# EAGLE schematic ESP32 (EAGLE 9.6.2)
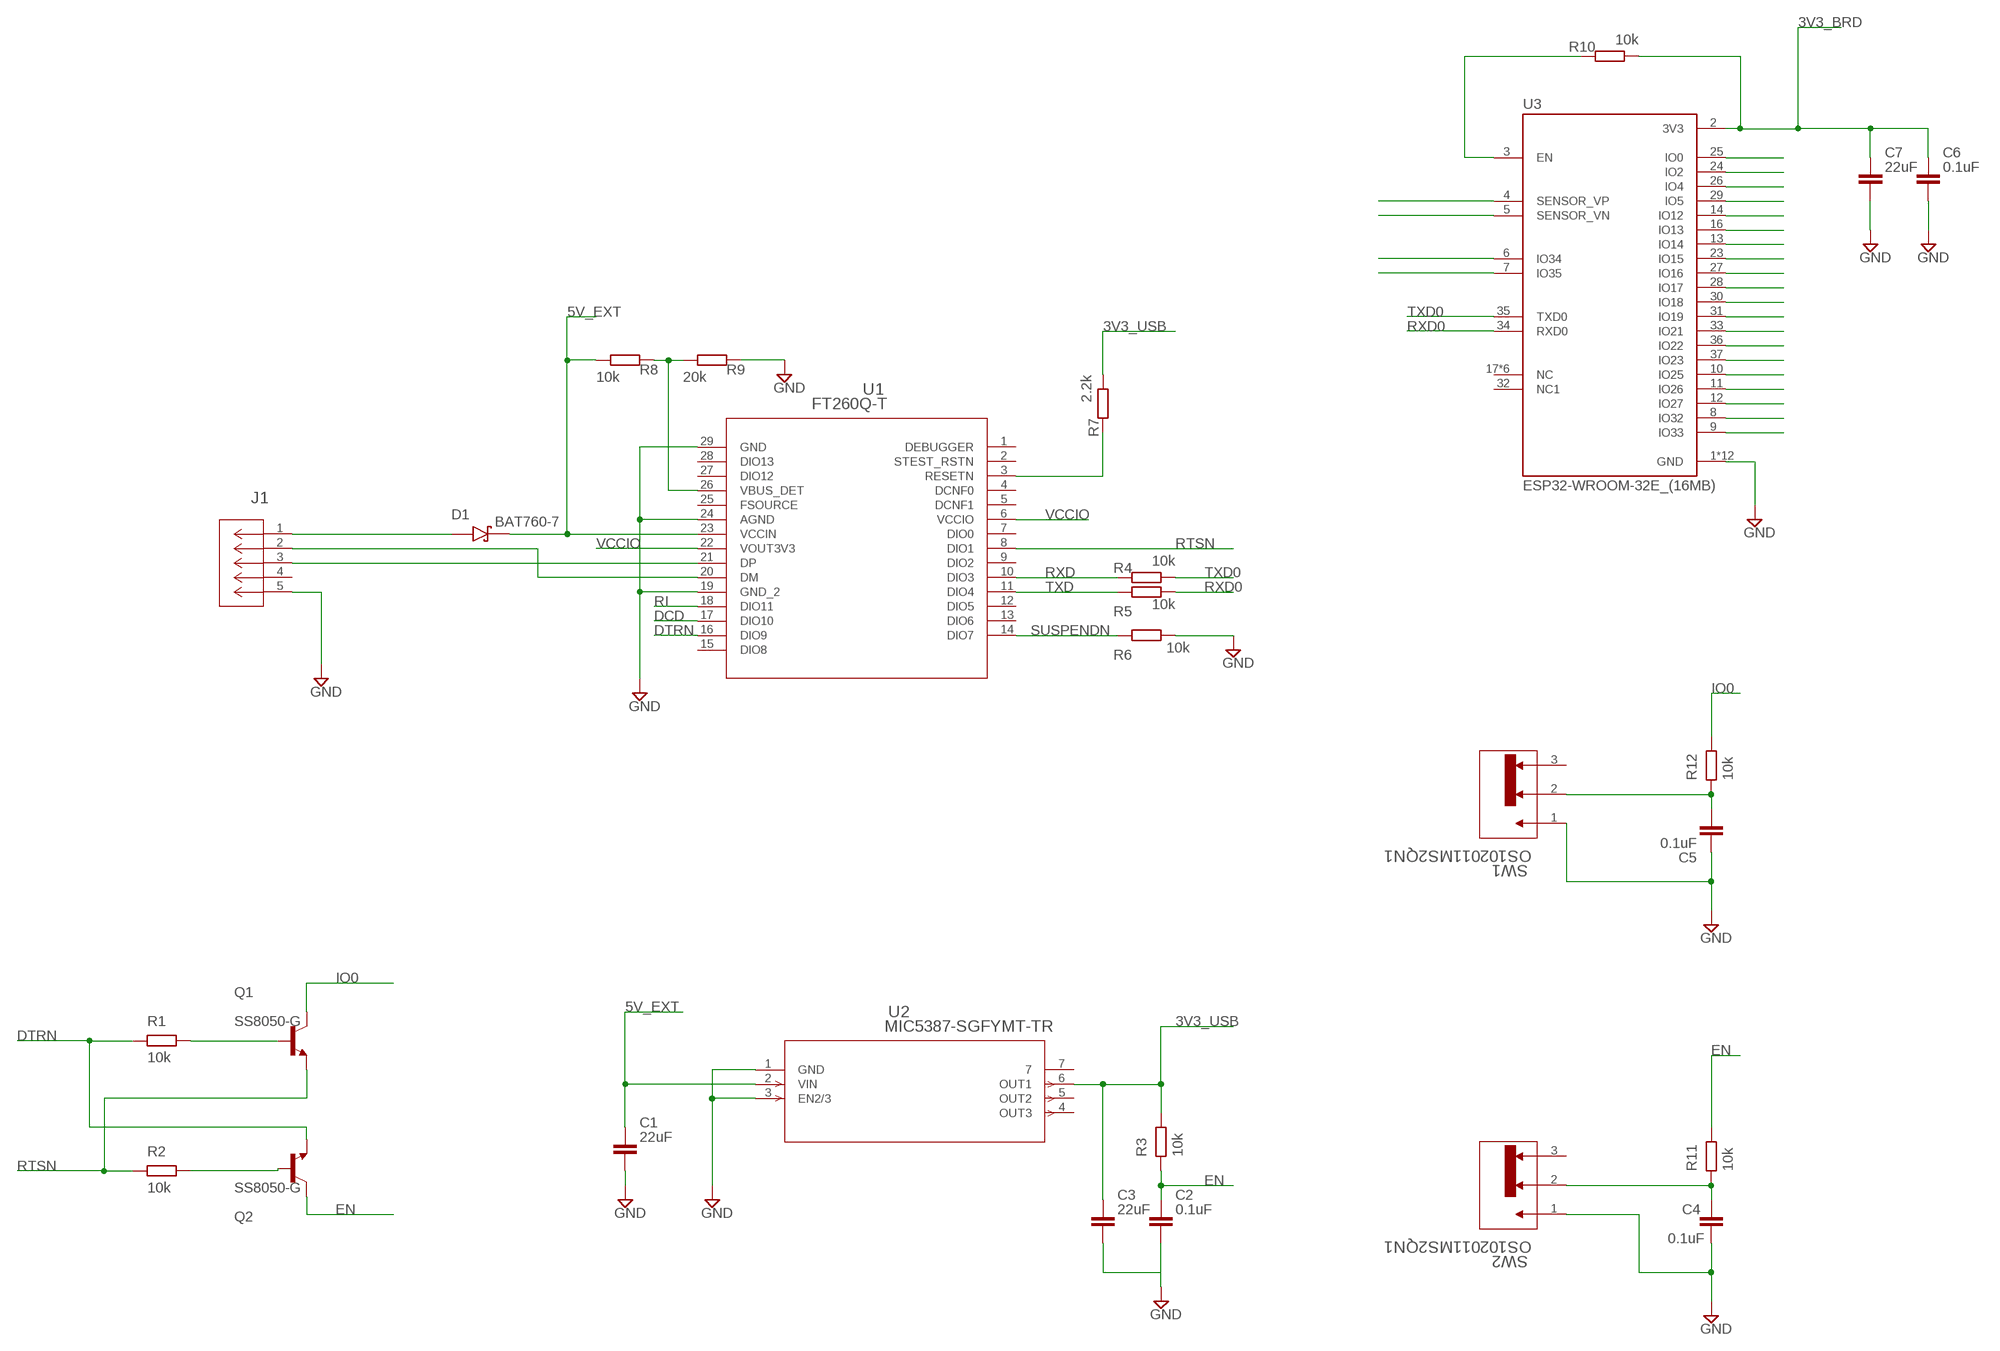
[diagram p0: schematic, sheet 1]

## Parts
C1  22uF  C  (no package)
C2  0.1uF  C  (no package)
C3  22uF  C  (no package)
C4  0.1uF  C  (no package)
C5  0.1uF  C  (no package)
C6  0.1uF  C  (no package)
C7  22uF  C  (no package)
D1  BAT760-7  [SOD2513X120N]
J1  10118193-0001LF  [CONN_10118193-0001LF_AMP]
Q1  SS8050-G  [TRANS_SS8050-G]
Q2  SS8050-G  [TRANS_SS8050-G]
R1  10k  R  (no package)
R2  10k  R  (no package)
R3  10k  R  (no package)
R4  10k  R  (no package)
R5  10k  R  (no package)
R6  10k  R  (no package)
R7  2.2k  R  (no package)
R8  10k  R  (no package)
R9  20k  R  (no package)
R10  10k  R  (no package)
R11  10k  R  (no package)
R12  10k  R  (no package)
SW1  OS102011MS2QN1  [SPDT_OS102011_CNK]
SW2  OS102011MS2QN1  [SPDT_OS102011_CNK]
U1  FT260Q-T  [WQFN-28_FTD]
U2  MIC5387-SGFYMT-TR  [MLF-6_MT_MCH]
U3  ESP32-WROOM-32E_(16MB)  [XCVR_ESP32-WROOM-32E_(16MB)]

## Nets
3V3_BRD: C6.1 C7.1 R10.1 U3.2(3V3)
3V3_USB: C3.1 R3.2 R7.1 U2.6(OUT1)
5V_EXT: C1.1 D1.C(K) R8.1 U1.23(VCCIN) U2.2(VIN)
DCD: U1.17(DIO10)
DTRN: Q2.2(E) R1.1 U1.16(DIO9)
EN: C2.1 C4.1 Q2.3(C) R3.1 R11.1 SW2.2
GND: C1.2 C2.2 C3.2 C4.2 C5.1 C6.2 C7.2 J1.5 R6.1 R9.2 SW1.1 SW2.1 U1.19(GND_2) U1.24(AGND) U1.29(GND) U2.1(GND) U2.3(EN2/3) U3.1(GND) U3.15(GND) U3.38(GND) U3.39_1(GND) U3.39_2(GND) U3.39_3(GND) U3.39_4(GND) U3.39_5(GND) U3.39_6(GND) U3.39_7(GND) U3.39_8(GND) U3.39_9(GND)
IO0: C5.2 Q1.3(C) R12.1 SW1.2
N$1: D1.A J1.1
N$2: J1.2 U1.20(DM)
N$3: J1.3 U1.21(DP)
N$4: U3.25(IO0)
N$5: R11.2
N$6: R7.2 U1.3(RESETN)
N$7: R8.2 R9.1 U1.26(VBUS_DET)
N$8: Q1.1(B) R1.2
N$9: Q2.1(B) R2.2
N$10: R10.2 U3.3(EN)
N$11: R12.2
N$12: U3.24(IO2)
N$13: U3.26(IO4)
N$14: U3.29(IO5)
N$15: U3.14(IO12)
N$16: U3.16(IO13)
N$17: U3.13(IO14)
N$18: U3.23(IO15)
N$19: U3.27(IO16)
N$20: U3.28(IO17)
N$21: U3.30(IO18)
N$22: U3.31(IO19)
N$23: U3.33(IO21)
N$24: U3.36(IO22)
N$25: U3.37(IO23)
N$26: U3.10(IO25)
N$27: U3.11(IO26)
N$28: U3.12(IO27)
N$29: U3.8(IO32)
N$30: U3.9(IO33)
N$31: U3.4(SENSOR_VP)
N$32: U3.5(SENSOR_VN)
N$33: U3.6(IO34)
N$34: U3.7(IO35)
RI: U1.18(DIO11)
RTSN: Q1.2(E) R2.1 U1.8(DIO1)
RXD: R4.2 U1.10(DIO3)
RXD0: R5.1 U3.34(RXD0)
SUSPENDN: R6.2 U1.14(DIO7)
TXD: R5.2 U1.11(DIO4)
TXD0: R4.1 U3.35(TXD0)
VCCIO: U1.6(VCCIO) U1.22(VOUT3V3)
Unconnected: J1.4 SW1.3 SW2.3 U1.1(DEBUGGER) U1.2(STEST_RSTN) U1.4(DCNF0) U1.5(DCNF1) U1.7(DIO0) U1.9(DIO2) U1.12(DIO5) U1.13(DIO6) U1.15(DIO8) U1.27(DIO12) U1.28(DIO13) U2.4(OUT3) U2.5(OUT2) U2.7 U3.17(NC) U3.18(NC) U3.19(NC) U3.20(NC) U3.21(NC) U3.22(NC) U3.32(NC1)

## Power pins joined to a net without a drawn wire
FSOURCE: U1.25(FSOURCE)

## Library data of the parts
C1-C7 = ngspice-simulation:C: CAPACITOR
D1 = BAT760-7:BAT760-7: Diode Schottky 30V 1A Surface Mount SOD-323; MANUFACTURER: DIODES; MAXIMUM_PACKAGE_HEIGHT: 1.20mm; PARTREV: 9-2; STANDARD: IPC-7351B
J1 = USB:10118193-0001LF; COPYRIGHT: Copyright (C) 2024 Ultra Librarian. All rights reserved.; MANUFACTURER_PART_NUMBER: 10118193-0001LF; MFR_NAME: Amphenol ICC; TYPE: USB, DVI, HDMI, Connectors
Q1 Q2 = SS8050-G:SS8050-G: Bipolar (BJT) Transistor NPN 25 V 1.5 A 100MHz 300 mW Surface Mount SOT-23-3; MANUFACTURER: Comchip; MAXIMUM_PACKAGE_HEIGHT: 1.05 mm; PARTREV: A; STANDARD: Manufacturer Recommendations
R1-R12 = ngspice-simulation:R: RESISTOR
SW1 SW2 = OS102011MS2QN1:OS102011MS2QN1; COPYRIGHT: Copyright (C) 2024 Ultra Librarian. All rights reserved.; MANUFACTURER_PART_NUMBER: OS102011MS2QN1; MFR_NAME: C&K Components; TYPE: Slide Switches
U1 = FT260Q_T:FT260Q-T; COPYRIGHT: Copyright (C) 2024 Ultra Librarian. All rights reserved.; MANUFACTURER_PART_NUMBER: FT260Q-T; MFR_NAME: FTDI, Future Technology Devices International Ltd
U2 = MIC5387_5V_to_3V3:MIC5387-SGFYMT-TR; COPYRIGHT: Copyright (C) 2024 Ultra Librarian. All rights reserved.; MANUFACTURER_PART_NUMBER: MIC5387-SGFYMT-TR; MFR_NAME: Microchip
U3 = ESP32-WROOM-32E__16MB_:ESP32-WROOM-32E_(16MB): Check availability <https://pricing.snapeda.com/parts/ESP32-WROOM-32E%20%2816MB%29/Espressif%20Systems/view-part?ref=eda>; AVAILABILITY: Not in stock; CHECK_PRICES: https://www.snapeda.com/parts/ESP32-WROOM-32E%20(16MB)/Espressif+Systems/view-part/?ref=eda; DESCRIPTION: Bluetooth, WiFi 802.11b/g/n, Bluetooth v4.2 +EDR, Class 1, 2 and 3 Transceiver Module 2.4GHz ~ 2.5GHz Integrated, Trace Surface Mount; MF: Espressif Systems; MP: ESP32-WROOM-32E (16MB); PACKAGE: SMD-44 Espressif Systems; PRICE: None; SNAPEDA_LINK: https://www.snapeda.com/parts/ESP32-WROOM-32E%20(16MB)/Espressif+Systems/view-part/?ref=snap